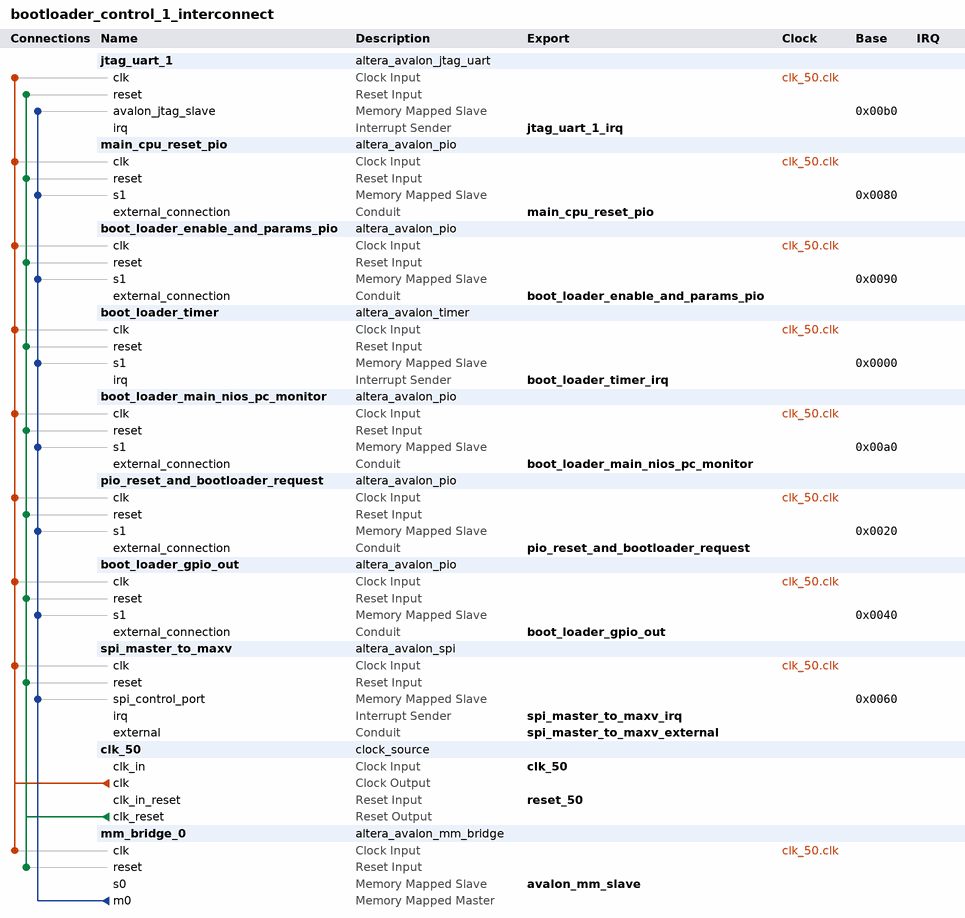
[diagram p0: system contents]
# Platform Designer (Qsys) system bootloader_control_1_interconnect, Arria V 5AGXFB3H4F35C4
# Parameters at their usual value, and those the tool derives, are not listed.
package require -exact qsys 14.1
create_system bootloader_control_1_interconnect
set_project_property DEVICE_FAMILY {Arria V}
set_project_property DEVICE 5AGXFB3H4F35C4

add_instance jtag_uart_1 altera_avalon_jtag_uart 14.1
set_instance_parameter_value jtag_uart_1 readBufferDepth 256
set_instance_parameter_value jtag_uart_1 simInteractiveOptions NO_INTERACTIVE_WINDOWS
set_instance_parameter_value jtag_uart_1 writeBufferDepth 256

add_instance main_cpu_reset_pio altera_avalon_pio 14.1
set_instance_parameter_value main_cpu_reset_pio captureEdge true
set_instance_parameter_value main_cpu_reset_pio direction InOut
set_instance_parameter_value main_cpu_reset_pio resetValue 1
set_instance_parameter_value main_cpu_reset_pio width 1

add_instance boot_loader_enable_and_params_pio altera_avalon_pio 14.1
set_instance_parameter_value boot_loader_enable_and_params_pio direction Input
set_instance_parameter_value boot_loader_enable_and_params_pio width 32

add_instance boot_loader_timer altera_avalon_timer 14.1
set_instance_parameter_value boot_loader_timer period 1
set_instance_parameter_value boot_loader_timer periodUnits MSEC

add_instance boot_loader_main_nios_pc_monitor altera_avalon_pio 14.1
set_instance_parameter_value boot_loader_main_nios_pc_monitor direction Input
set_instance_parameter_value boot_loader_main_nios_pc_monitor width 32

add_instance pio_reset_and_bootloader_request altera_avalon_pio 14.1
set_instance_parameter_value pio_reset_and_bootloader_request bitModifyingOutReg true
set_instance_parameter_value pio_reset_and_bootloader_request direction Output
set_instance_parameter_value pio_reset_and_bootloader_request width 32

add_instance boot_loader_gpio_out altera_avalon_pio 14.1
set_instance_parameter_value boot_loader_gpio_out bitModifyingOutReg true
set_instance_parameter_value boot_loader_gpio_out direction Output
set_instance_parameter_value boot_loader_gpio_out width 8

add_instance spi_master_to_maxv altera_avalon_spi 14.1
set_instance_parameter_value spi_master_to_maxv clockPhase 1
set_instance_parameter_value spi_master_to_maxv clockPolarity 0
set_instance_parameter_value spi_master_to_maxv dataWidth 8
set_instance_parameter_value spi_master_to_maxv insertSync true
set_instance_parameter_value spi_master_to_maxv masterSPI true
set_instance_parameter_value spi_master_to_maxv numberOfSlaves 1
set_instance_parameter_value spi_master_to_maxv syncRegDepth 3
set_instance_parameter_value spi_master_to_maxv targetClockRate 32000

add_instance clk_50 clock_source 14.1
set_instance_parameter_value clk_50 clockFrequency 50000000

add_instance mm_bridge_0 altera_avalon_mm_bridge 14.1
set_instance_parameter_value mm_bridge_0 ADDRESS_UNITS SYMBOLS
set_instance_parameter_value mm_bridge_0 ADDRESS_WIDTH 16
set_instance_parameter_value mm_bridge_0 DATA_WIDTH 32
set_instance_parameter_value mm_bridge_0 MAX_PENDING_RESPONSES 4
set_instance_parameter_value mm_bridge_0 USE_AUTO_ADDRESS_WIDTH 0

# connections
add_connection clk_50.clk boot_loader_enable_and_params_pio.clk clock
add_connection clk_50.clk boot_loader_gpio_out.clk clock
add_connection clk_50.clk boot_loader_main_nios_pc_monitor.clk clock
add_connection clk_50.clk boot_loader_timer.clk clock
add_connection clk_50.clk jtag_uart_1.clk clock
add_connection clk_50.clk main_cpu_reset_pio.clk clock
add_connection clk_50.clk mm_bridge_0.clk clock
add_connection clk_50.clk pio_reset_and_bootloader_request.clk clock
add_connection clk_50.clk spi_master_to_maxv.clk clock
add_connection clk_50.clk_reset boot_loader_enable_and_params_pio.reset reset
add_connection clk_50.clk_reset boot_loader_gpio_out.reset reset
add_connection clk_50.clk_reset boot_loader_main_nios_pc_monitor.reset reset
add_connection clk_50.clk_reset boot_loader_timer.reset reset
add_connection clk_50.clk_reset jtag_uart_1.reset reset
add_connection clk_50.clk_reset main_cpu_reset_pio.reset reset
add_connection clk_50.clk_reset mm_bridge_0.reset reset
add_connection clk_50.clk_reset pio_reset_and_bootloader_request.reset reset
add_connection clk_50.clk_reset spi_master_to_maxv.reset reset
add_connection mm_bridge_0.m0 boot_loader_enable_and_params_pio.s1 avalon
set_connection_parameter_value mm_bridge_0.m0/boot_loader_enable_and_params_pio.s1 baseAddress 0x0090
add_connection mm_bridge_0.m0 boot_loader_gpio_out.s1 avalon
set_connection_parameter_value mm_bridge_0.m0/boot_loader_gpio_out.s1 baseAddress 0x0040
add_connection mm_bridge_0.m0 boot_loader_main_nios_pc_monitor.s1 avalon
set_connection_parameter_value mm_bridge_0.m0/boot_loader_main_nios_pc_monitor.s1 baseAddress 0x00a0
add_connection mm_bridge_0.m0 boot_loader_timer.s1 avalon
set_connection_parameter_value mm_bridge_0.m0/boot_loader_timer.s1 baseAddress 0x0000
add_connection mm_bridge_0.m0 jtag_uart_1.avalon_jtag_slave avalon
set_connection_parameter_value mm_bridge_0.m0/jtag_uart_1.avalon_jtag_slave baseAddress 0x00b0
add_connection mm_bridge_0.m0 main_cpu_reset_pio.s1 avalon
set_connection_parameter_value mm_bridge_0.m0/main_cpu_reset_pio.s1 baseAddress 0x0080
add_connection mm_bridge_0.m0 pio_reset_and_bootloader_request.s1 avalon
set_connection_parameter_value mm_bridge_0.m0/pio_reset_and_bootloader_request.s1 baseAddress 0x0020
add_connection mm_bridge_0.m0 spi_master_to_maxv.spi_control_port avalon
set_connection_parameter_value mm_bridge_0.m0/spi_master_to_maxv.spi_control_port baseAddress 0x0060

# exported interfaces
add_interface avalon_mm_slave avalon slave
set_interface_property avalon_mm_slave EXPORT_OF mm_bridge_0.s0
add_interface boot_loader_enable_and_params_pio conduit end
set_interface_property boot_loader_enable_and_params_pio EXPORT_OF boot_loader_enable_and_params_pio.external_connection
add_interface boot_loader_gpio_out conduit end
set_interface_property boot_loader_gpio_out EXPORT_OF boot_loader_gpio_out.external_connection
add_interface boot_loader_main_nios_pc_monitor conduit end
set_interface_property boot_loader_main_nios_pc_monitor EXPORT_OF boot_loader_main_nios_pc_monitor.external_connection
add_interface boot_loader_timer_irq interrupt sender
set_interface_property boot_loader_timer_irq EXPORT_OF boot_loader_timer.irq
add_interface clk_50 clock sink
set_interface_property clk_50 EXPORT_OF clk_50.clk_in
add_interface jtag_uart_1_irq interrupt sender
set_interface_property jtag_uart_1_irq EXPORT_OF jtag_uart_1.irq
add_interface main_cpu_reset_pio conduit end
set_interface_property main_cpu_reset_pio EXPORT_OF main_cpu_reset_pio.external_connection
add_interface pio_reset_and_bootloader_request conduit end
set_interface_property pio_reset_and_bootloader_request EXPORT_OF pio_reset_and_bootloader_request.external_connection
add_interface reset_50 reset sink
set_interface_property reset_50 EXPORT_OF clk_50.clk_in_reset
add_interface spi_master_to_maxv_external conduit end
set_interface_property spi_master_to_maxv_external EXPORT_OF spi_master_to_maxv.external
add_interface spi_master_to_maxv_irq interrupt sender
set_interface_property spi_master_to_maxv_irq EXPORT_OF spi_master_to_maxv.irq

set_interconnect_requirement {$system} qsys_mm.clockCrossingAdapter AUTO
set_interconnect_requirement {$system} qsys_mm.maxAdditionalLatency 1

save_system bootloader_control_1_interconnect.qsys
